# EAGLE design switch_v4 (EAGLE 9.3.1)
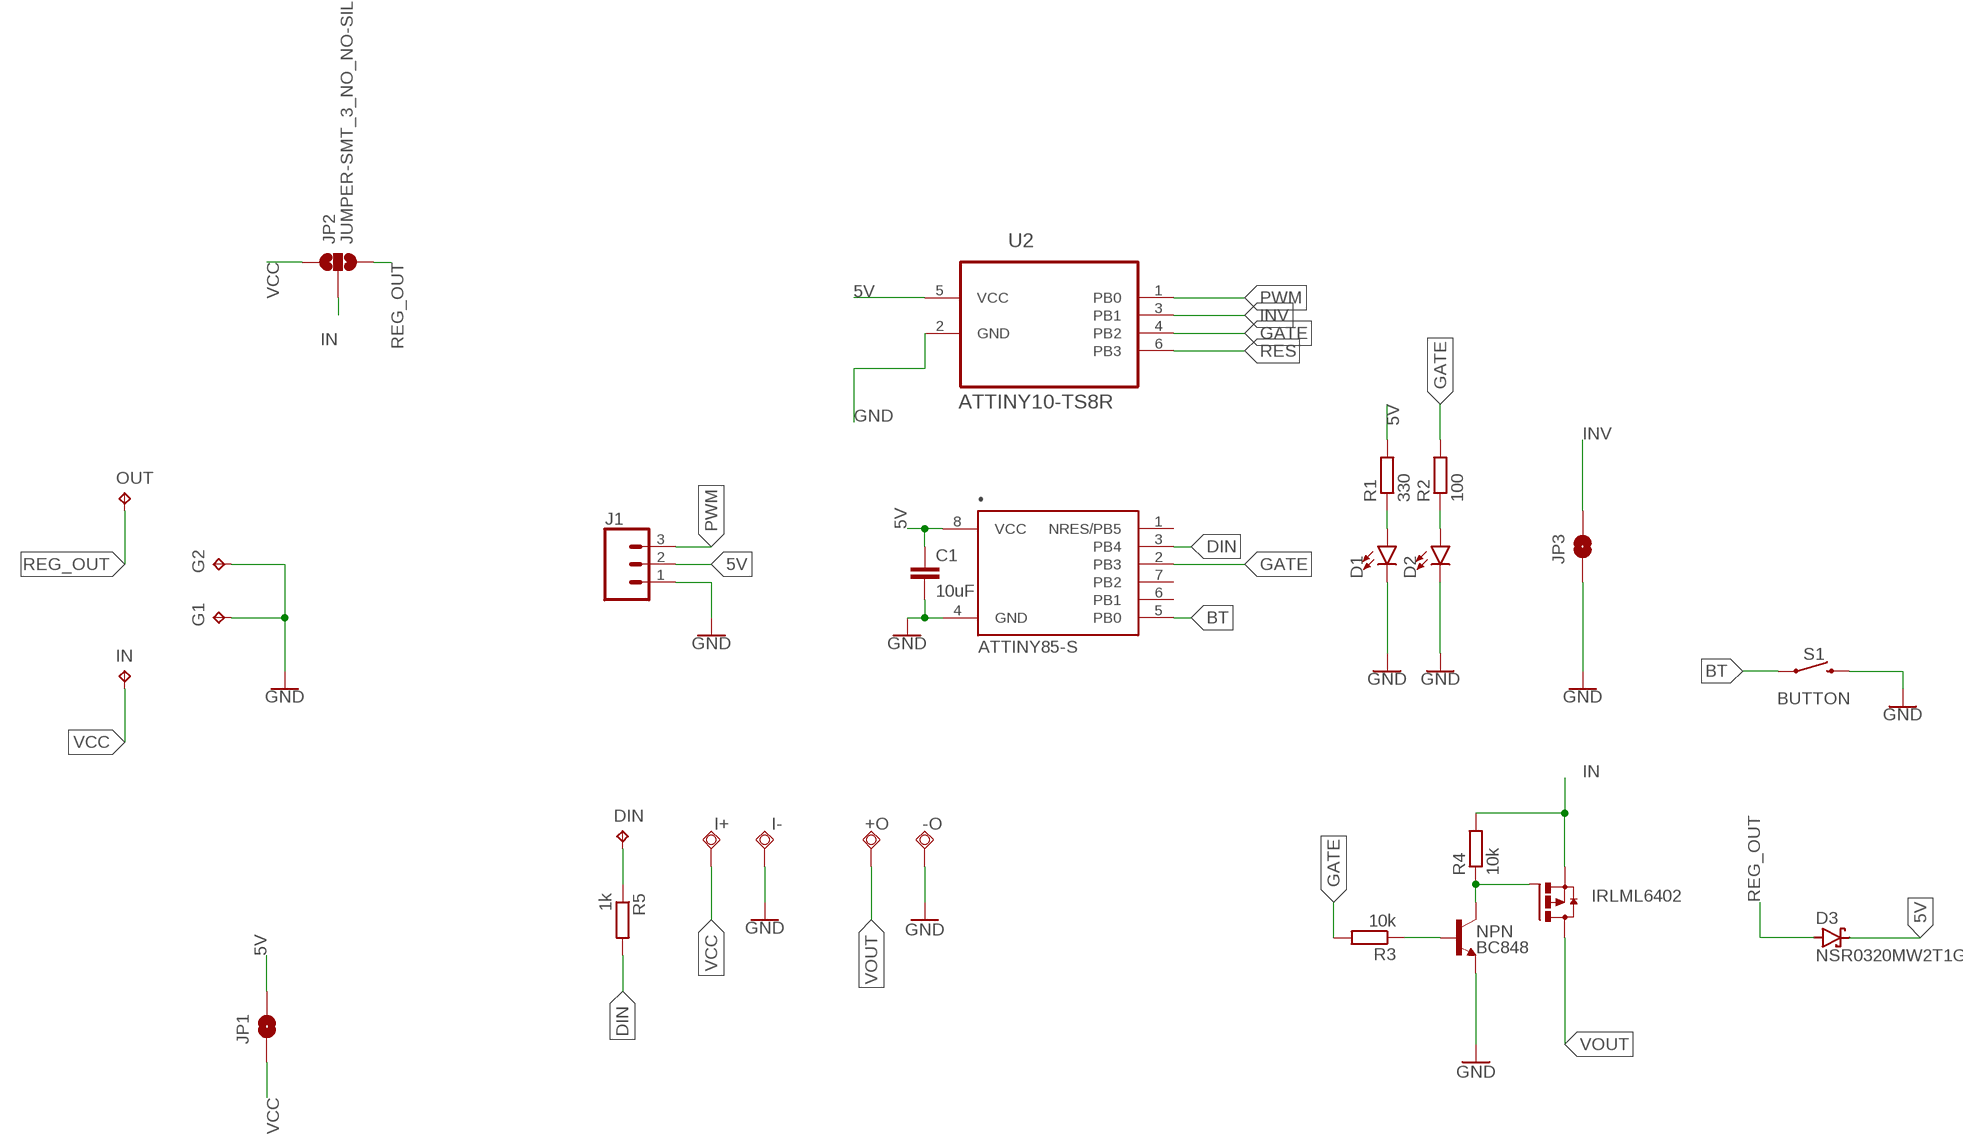
[diagram p0: schematic, sheet 1]

## Parts
+O  TPSQTP20SQ  [TP20SQ]
-O  TPSQTP20SQ  [TP20SQ]
C1  10uF  C-EUC0603K  [C0603K]
D1  LED0603  [LED-0603]
D2  LED0603  [LED-0603]
D3  NSR0320MW2T1G  BAT60J  [SOD323_ST]
DIN  TPTP15R  [TP15R]
G1  TPTP15R  [TP15R]
G2  TPTP15R  [TP15R]
I+  TPSQTP20SQ  [TP20SQ]
I-  TPSQTP20SQ  [TP20SQ]
IN  TPTP15R  [TP15R]
IRLML6402  FDN360P  [SUPER-SOT3]
J1  CONN_03  [1X03]
JP1  JUMPER-SMT_2_NO_NO-SILK  [SMT-JUMPER_2_NO_NO-SILK]
JP2  JUMPER-SMT_3_NO_NO-SILK  [SMT-JUMPER_3_NO_NO-SILK]
JP3  JUMPER-SMT_2_NO_NO-SILK  [SMT-JUMPER_2_NO_NO-SILK]
NPN  BC848  TRANS_NPN-MMBT2222AL  [SOT23-3]
OUT  TPTP15R  [TP15R]
R1  330  R-EU_R0603  [R0603]
R2  100  R-EU_R0603  [R0603]
R3  10k  R-EU_R0603  [R0603]
R4  10k  R-EU_R0603  [R0603]
R5  1k  R-EU_R0603  [R0603]
S1  BUTTON  MOMENTARY-SWITCH-SPST-SMD-4.6X2.8MM  [TACTILE_SWITCH_SMD_4.6X2.8MM]
U2  ATTINY10-TS8R  [SOT95P280X145-6N]
•  ATTINY85-S  [SOIC8_EIAJ_208MIL]

## Nets
5V: C1.1 D3.C J1.2 JP1.2 R1.2 U2.5(VCC) •.8(VCC)
BT: S1.1 S1.2 •.5(PB0)
DIN: R5.2 •.3(PB4)
GATE: R2.2 R3.2 U2.4(PB2) •.2(PB3)
GND: -O.TP C1.2 D1.C D2.C G1.TP G2.TP I-.TP J1.1 JP3.1 NPN.2(E) S1.3 S1.4 U2.2(GND) •.4(GND)
IN [vcc]: IRLML6402.2(S) JP2.2 R4.2
INV: JP3.2 U2.3(PB1)
N$1: NPN.1(B) R3.1
N$2: DIN.TP R5.1
N$3: D1.A R1.1
N$4: D2.A R2.1
NN: IRLML6402.1(G) NPN.3(C) R4.1
PWM: J1.3 U2.1(PB0)
REG_OUT: D3.A JP2.3 OUT.TP
RES: U2.6(PB3)
VCC [vcc]: I+.TP IN.TP JP1.1 JP2.1
VOUT [vcc]: +O.TP IRLML6402.3(D)
Unconnected: •.1(NRES/PB5) •.6(PB1) •.7(PB2)

## Library data of the parts
+O -O I+ I- = testpad:TPSQ: Test pad
C1 = rcl:C-EU: CAPACITOR, European symbol; SPICEPREFIX: C
D1 D2 = SparkFun-LED:LED: LED (Generic) Standard schematic elements and footprints for 5mm, 3mm, 1206, and 0603 sized LEDs. Generic LEDs with no color specified.
D3 = diode:BAT60J: Schottky barrier diode Source: www.st.com, BAT60J.pdf
DIN G1 G2 IN OUT = testpad:TP: Test pad
IRLML6402 = transistor-power:FDN360P: Single P-Channel, PowerTrench (R) MOSFET Source: http://www.fairchildsemi.com/ds/FD/FDN360P.pdf
J1 = SparkFun-Connectors:CONN_03: Multi connection point. Often used as Generic Header-pin footprint for 0.1 inch spaced/style header connections On any of the 0.1 inch spaced packages, you can populate with these: Break Away Headers - Straight <https://www.sparkfun.com/products/116> (PRT-00116) Break Away Male Headers - Right Angle <https://www.sparkfun.com/products/553> (PRT-00553) Female Headers <https://www.sparkfun.com/products/115> (PRT-00115) Break Away Headers - Machine Pin <https://www.sparkfun.com/products/117> (PRT-00117) Break Away Female Headers - Swiss Machine Pin <https://www.sparkfun.com/products/743> (PRT-00743) Stackable Header - 3 Pin (Female, 0.1") <https://www.sparkfun.com/products/13875> (PRT-13875) For SCREWTERMINALS and SPRING TERMINALS visit here: Screw Terimnals on SparkFun.com <https://www.sparkfun.com/search/results?term=Screw+Terminals> (5mm/3.5mm/2.54mm spacing) This device is also useful as a general connection point to wire up your design to another part of your project. Our various solder wires solder well into these plated through hole pads. Hook-Up Wire - Assortment (Stranded, 22 AWG) <https://www.sparkfun.com/products/11375> (PRT-11375) Hook-Up Wire - Assortment (Solid Core, 22 AWG) <https://www.sparkfun.com/products/11367> (PRT-11367) View the entire wire category on our website here <https://www.sparkfun.com/categories/141> Special notes: Molex polarized connector foot print use with SKU : PRT-08232 with associated crimp pins and housings.
JP1 JP3 = SparkFun-Jumpers:JUMPER-SMT_2_NO: Normally open jumper This jumper has two pads in close proximity to each other. Apply solder to close the connection. Round pads are easier to solder for beginners, but are a lot larger. SparkFun Product that uses the round pads: SparkFun EL Sequencer <https://www.sparkfun.com/products/12781>
JP2 = SparkFun-Jumpers:JUMPER-SMT_3_NO: Normally open jumper This jumper has three pads in close proximity to each other. Apply solder to close the connection(s).
NPN = SparkFun-DiscreteSemi:TRANS_NPN: NPN transistor Current controlled devices typically used to amplify current or used as a switch. BC547 - COM-08928 <http://www.sparkfun.com/products/8928> (TO-92 45V 100mA) (1.Collector 2.Base 3.Emitter) 2N3904 - COM-00521 <http://www.sparkfun.com/products/521> (TO-92 40V 200mA) (1.Emitter 2.Base 3.Collector) P2N2222A - COM-12852 <http://www.sparkfun.com/products/12852> (TO-92 40V 600mA) (1.Collector 2.Base 3.Emitter); PROD_ID: TRANS-08049; VALUE: 600mA/40V
R1-R5 = rcl:R-EU_: RESISTOR, European symbol; SPICEPREFIX: R
S1 = SparkFun-Switches:MOMENTARY-SWITCH-SPST: Momentary Switch (Pushbutton) - SPST Normally-open (NO) SPST momentary switches (buttons, pushbuttons). Variants PTH-12MM - 12mm square, through-hole Momentary Pushbutton Switch - 12mm Square <https://www.sparkfun.com/products/9190> (COM-09190) PTH-6.0MM, PTH-6.0MM-KIT - 6.0mm square, through-hole Mini Pushbutton Switch <https://www.sparkfun.com/products/97> (COM-00097) KIT package intended for soldering kit's - only one side of pads' copper is exposed. PTH-RIGHT-ANGLE-KIT - Right-angle, through-hole Right Angle Tactile Button <https://www.sparkfun.com/products/10791> - Used on SparkFun BigTime Watch Kit <https://www.sparkfun.com/products/11734> SMD-12MM - 12mm square, surface-mount Tactile Button - SMD (12mm) <https://www.sparkfun.com/products/12993> (COM-12993) Used on SparkFun PicoBoard <https://www.sparkfun.com/products/11888> SMD-4.5MM - 4.5mm Square Trackball Switch Used on SparkFun Blackberry Trackballer Breakout <https://www.sparkfun.com/products/13169> SMD-4.6MMX2.8MM - 4.60mm x 2.80mm, surface mount Used on SparkFun SAMD21 Mini Breakout <https://www.sparkfun.com/products/13664> SMD-5.2MM, SMD-5.2-REDUNDANT - 5.2mm square, surface-mount Mini Pushbutton Switch - SMD <https://www.sparkfun.com/products/8720> (COM-08720) Used on Arduino Pro Mini <https://www.sparkfun.com/products/11114> REDUNDANT package connects both switch circuits together SMD-6.0X3.5MM - 6.0 x 3.5mm, surface mount Momentary Reset Switch SMD <https://www.sparkfun.com/products/8229> (COM-08229) SMD-6.2MM-TALL - 6.2mm square, surface mount Tactile Button - SMD (6mm) <https://www.sparkfun.com/products/12992> Used on SparkFun Digital Sandbox <https://www.sparkfun.com/products/12651> SMD-RIGHT-ANGLE - Right-angle, surface mount Used on SparkFun Block for Intel® Edison - Arduino <https://www.sparkfun.com/products/13036>; PROD_ID: SWCH-13065
U2 = ATTINY10-TS8R:ATTINY10-TS8R: 8-bit Microcontroller with In-System Programmable Flash; AVAILABILITY: Unavailable; DESCRIPTION: Embedded microcontroller ATTINY10-TS8R SOT 23 Microchip Technology 8-Bit 10 MHz I/O number 4; MF: Microchip; MP: ATTINY10-TS8R; PACKAGE: SOT-23-6 Microchip; PRICE: None
• = _hhn_attiny25_45_85:ATTINY85*: ATMEL ATtiny 85 Packages: P = PDIP 08 30mil S = SOIC 08 EIAJ 208mil Technologies Note: for complete ordering code (temp. range, finish, tape&reel etc.) see www.atmel.com • Supply Voltage: V = (1.8…5.5)V | [blank] = (2.7…5.5)V • Speed: 10 = 10 MHz | 20 = 20 MHz Author: Dipl.-Ing. FH Rainer Bayer HHN Hochschule Heilbronn (Heilbronn University), rainer.bayer@hs-heilbronn.de Ingenieurbüro ing-rb, mail@ing-rb.de

## Net classes
1 vcc: width 0.5 mm, clearance 0.381 mm

## Board
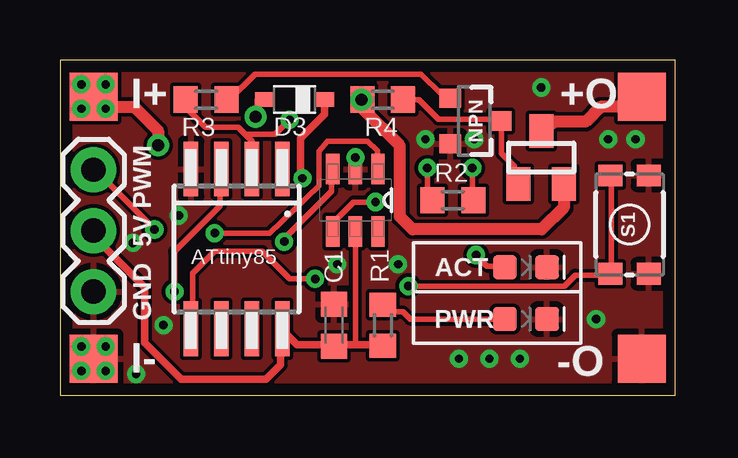
[diagram p1: board, top side]
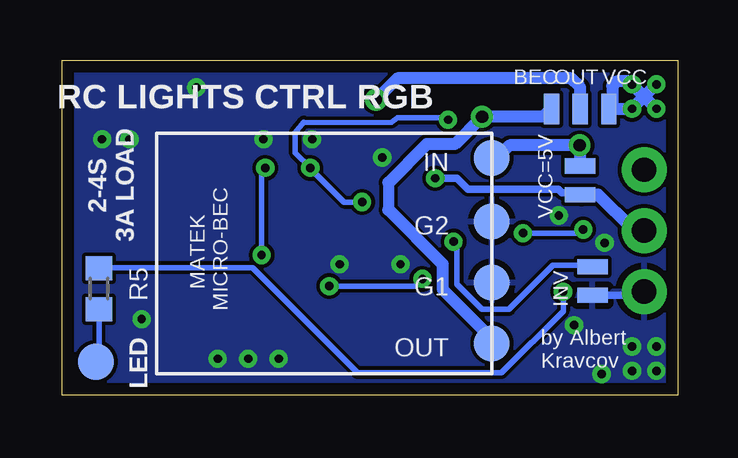
[diagram p2: board, bottom side, seen from below]

Size 25.65 x 13.97 mm. Coordinates in mm from the lower left corner, seen from the top.
Outline: 0,0 25.65,0 25.65,13.97 0,13.97 0,0
Copper layers (1*16): Top 0.035mm / dielectric 1.5mm / Bottom 0.035mm
Design rules "default *": minimum track width 6mil, minimum drill 0.35mm, track to track 6mil, track to pad 6mil, pad to pad 6mil, via to via 6mil, smd to smd 6mil, copper to edge 0.5mm, drill to drill 6mil, minimum pad ring 10mil, minimum via ring 8mil, stop-mask expansion 4mil, vias tented up to drill 2mm, thermal gap 10mil

### Footprints (pad centres in the part's own frame; a part is rotated, then mirrored left to right if it is on the bottom)
TP20SQ = smd 2 x 2: TP 0,0
C0603K = smd 1.05 x 1.08: 1 -0.875,0; 2 0.875,0
LED-0603 = smd 1 x 1: A -0.877,0; C 0.877,0
SOD323_ST = smd 0.8 x 0.6: A 1.25,0; C -1.25,0
TP15R = smd 1.5 x 1.5: TP 0,0
SUPER-SOT3 = smd 1 x 1.4: 1 -0.95,-1.1; 2 0.95,-1.1; 3 0,1.1
1X03 = drill 1.016 pad 1.88: 1 0,0; 2 2.54,0; 3 5.08,0
SMT-JUMPER_2_NO_NO-SILK = smd 0.635 x 1.27: 1 -0.66,0; 2 0.533,0
SMT-JUMPER_3_NO_NO-SILK = smd 0.635 x 1.27: 1 -1.194,0; 2 0,0; 3 1.194,0
SOT23-3 = smd 0.8 x 0.9: 1 -0.95,-1; 2 0.95,-1; 3 0,1.1
R0603 = smd 1 x 1.1: 1 -0.85,0; 2 0.85,0
TACTILE_SWITCH_SMD_4.6X2.8MM = smd 0.9 x 1: 1 -2.05,-0.8; 2 2.05,-0.8; 3 2.05,0.8; 4 -2.05,0.8
SOT95P280X145-6N = smd 1.27 x 0.559: 1 -1.295,0.94; 2 -1.295,0; 3 -1.295,-0.94; 4 1.295,-0.94; 5 1.295,0; 6 1.295,0.94
SOIC8_EIAJ_208MIL = smd 0.6 x 2.286: 1 -1.905,-3.33; 2 -0.635,-3.33; 3 0.635,-3.33; 4 1.905,-3.33; 5 1.905,3.33; 6 0.635,3.33; 7 -0.635,3.33; 8 -1.905,3.33

### Placement (x,y rotation side)
+O  24.26,12.45 0 top
-O  24.26,1.52 0 top
C1  11.43,2.92 90 top
D1  19.43,3.17 0 top
D2  19.43,5.33 0 top
D3  9.78,12.32 180 top
DIN  24.26,1.4 0 bottom
G1  7.75,4.7 0 bottom
G2  7.75,7.24 0 bottom
I+  1.4,12.45 0 top
I-  1.4,1.52 0 top
IN  7.75,9.88 0 bottom
IRLML6402  20.07,9.91 0 top
J1  1.4,4.32 90 top
JP1  4.06,8.89 270 bottom
JP2  4.06,11.94 180 bottom
JP3  3.56,4.83 90 bottom
NPN  17.27,11.43 270 top
OUT  7.75,2.16 0 bottom
R1  13.46,2.92 270 top
R2  16.38,8.13 180 top
R3  6.1,12.32 180 top
R4  13.46,12.32 180 top
R5  24.13,4.44 90 bottom
S1  23.75,7.11 270 top
U2  12.32,8.13 270 top
•  7.37,6.1 180 top

### Tracks (layer width: path | path; a pad name or v marks a point on that pad's centre or on a via)
5V  (via drill 0.35)
  Top 0.152: 13.31,2.11 13.46,1.96 R1.2 | 11.48,2.11 C1.1 11.41,2.11 | 9.27,2.72 •.8 9.5,2.41 9.2,2.11 | 10.03,9.04 10.07,9 v10.11,9.04 | D3.C | 1.42,6.83 J1.2
  Top 0.229: 12.32,2.11 U2.5
  Top 0.305: 13.31,2.11 12.32,2.11 11.48,2.11 | 11.41,2.11 9.88,2.11 9.27,2.72 | D3.C 11.02,11.71 10.03,10.72 10.03,9.04 | 9.2,2.11 9.2,1.27 8.59,0.66 5.05,0.66 3.53,2.18 3.53,4.5 1.42,6.6 1.42,6.83
  Bottom 0.152: 4.01,8.43 4.01,8.28 4.12,8.28 4.27,8.43 | 1.42,6.91 J1.2
  Bottom 0.305: v10.11,9.04 9.2,9.04 8.74,8.58 4.98,8.58 4.83,8.43 4.27,8.43
  Bottom 0.5: 3.33,8.36 JP1.2 4.06,8.33 4.01,8.28
  Bottom 0.508: 3.33,8.36 1.88,6.91 1.42,6.91
BT  (via drill 0.35)
  Top 0.152: 5.54,2.87 5.46,2.79 •.5 | 22.99,5.08 S1.2 22.91,5 | 22.99,9.12 S1.1
  Top 0.229: 5.54,2.87 5.54,5.08 6.45,5.99 8.43,5.99 9.58,4.85 v10.64,4.85 | 22.99,9.12 22.99,5.08 | 22.91,5 21.49,5 21.03,4.55 v14.53,4.55
  Bottom 0.229: v14.53,4.55 10.95,4.55 v10.64,4.85
DIN  (via drill 0.35)
  Top 0.152: 6.68,9.42 •.3
  Top 0.229: v4.77,4.32 4.77,5.99 6.68,7.9 6.68,9.42
  Bottom 0.152: R5.2
  Bottom 0.229: R5.2 17.73,5.31 13.36,0.94 7.34,0.94 4.77,3.5 v4.77,4.32
GATE  (via drill 0.35)
  Top 0.152: 5.31,11.94 5.31,12.32 R3.2 | 15.32,8.53 R2.2 | 11.41,7.21 11.41,6.83 U2.4
  Top 0.229: 5.31,11.94 6.07,11.18 7.42,11.18 7.72,10.87 | v15.32,9.47 15.32,8.53 | v9.58,11.48 8.97,10.87 7.72,10.87 | 11.41,7.21 12.24,8.05 v13.16,8.05 | •.2 8,10.59 7.72,10.87
  Bottom 0.203: 15.6,11.38 11.94,11.38
  Bottom 0.229: 15.6,11.38 15.95,10.95 15.95,10.11 v15.32,9.47 15.32,9.45 13.92,8.05 v13.16,8.05 | 11.94,11.38 11.68,11.56 9.65,11.56 v9.58,11.48
GND  (via drill 0.35)
  Bottom 0.152: J1.1 1.55,4.17
  Bottom 0.305: 1.55,4.17 JP3.1
  other vias: 0.89,2.03 0.89,1.02 1.91,1.02 1.91,2.03 4.95,7.49 12.32,9.91 11.56,5.46 14.1,5.46 22.86,10.67 22.35,3.17 17.27,10.67 24,10.67 20.07,12.83 15.24,10.67 16.64,1.52 17.91,1.52 19.18,1.52 3.05,6.35 3.17,0.89 4.32,2.92
  pour Top: -1.14,15.75 28.07,15.75 28.07,-2.03 -1.14,-2.03
  pour Bottom: -1.14,14.48 28.07,14.48 28.07,-2.03 -1.14,-2.03
IN  (via drill 0.51)
  Top 0.5: IRLML6402.2 21.01,8.74 21.01,7.82 20.09,6.91 14.71,6.91 14.17,7.44 14.17,10.39 12.62,11.94 R4.2 v12.57,12.32
  Bottom 0.5: v12.57,12.32 11.68,13.21 4.44,13.21 4.06,12.83 JP2.2
INV  (via drill 0.35)
  Top 0.152: 11.33,9.42 U2.3
  Top 0.229: v9.35,6.4 9.35,6.53 11.33,8.51 11.33,9.42
  Bottom 0.152: JP3.2 3.67,5.25
  Bottom 0.229: 3.67,5.25 3.83,5.41 5.21,5.41 7.04,3.58 8.15,3.58 9.2,4.62 9.2,6.25 v9.35,6.4
N$1
  Top 0.152: R3.1 7.06,12.32 | 16,12.55 NPN.1
  Top 0.229: 16,12.55 15.9,12.55 15.06,13.39 8.13,13.39 7.06,12.32
N$2
  Bottom 0.152: 24.13,1.5 24.21,1.42 DIN.TP
  Bottom 0.229: 24.13,1.5 R5.1
N$3
  Top 0.152: 13.61,3.48 13.46,3.63 R1.1
  Top 0.229: D1.A 14.61,3.17 14.3,3.48 13.61,3.48
N$4  (via drill 0.35)
  Top 0.152: 18.49,5.39 D2.A | 17.2,8.15 R2.1
  Top 0.229: 18.49,5.39 17.8,5.39 v17.35,5.84 | 17.2,8.15 v17.2,9.47
  Bottom 0.152: v17.2,9.47 17.35,9.32
  Bottom 0.229: 17.35,9.32 v17.35,5.84
NN
  Top 0.152: 18.95,8.97 19.1,8.81 IRLML6402.1 | 18.41,11.43 NPN.3 18.37,11.51
  Top 0.229: 18.41,11.43 18.41,10.08 18.95,9.55 18.95,8.97 | R4.1 14.96,12.32 15.77,11.51 18.37,11.51
PWM  (via drill 0.35)
  Top 0.152: 13.23,9.42 U2.1
  Top 0.229: v3.94,6.91 3.94,6.93 1.47,9.4 J1.3 | 13.23,9.42 13.23,10.19 12.83,10.59 11.15,10.59 10.79,10.16 10.79,8.74 8.74,6.76 v6.45,6.76
  Bottom 0.229: v6.45,6.76 4.09,6.76 v3.94,6.91
REG_OUT  (via drill 0.51)
  Top 0.152: 8.26,12.32 D3.A
  Top 0.305: 8.26,12.32 8.26,11.61 v8.15,11.61
  Bottom 0.152: 7.75,2.36 OUT.TP
  Bottom 0.457: 12.07,8.86 12.07,7.72
  Bottom 0.5: JP2.3 5.28,11.94
  Bottom 0.508: 5.28,11.94 5.61,11.61 v8.15,11.61 9.3,10.47 10.46,10.47 12.07,8.86 | 7.75,2.36 9.8,4.42 9.8,5.46 12.07,7.72
VCC  (via drill 0.35, 0.51)
  Top 0.5: v4.09,10.41 4.09,11.02 3.1,12.01 1.8,12.01 1.4,12.42 I+.TP | I+.TP v1.91,11.94 | I+.TP v0.89,11.94
  Bottom 0.5: IN.TP 7.62,9.8 7.01,10.41 v4.09,10.41 4.06,10.39 JP1.1 | v0.89,11.94 v1.91,12.95 2.03,13.08 2.54,13.08 2.73,12.89 2.73,11.94 | v0.89,12.95 v1.91,11.94 2.73,11.94 | JP2.1 2.73,11.94
VOUT
  Top 0.5: +O.TP 23.82,12.01 22.53,12.01 21.92,11.41 20.64,11.41 IRLML6402.3

### Text on the board
tNames: PWM | 5V | ATtiny85 | ACT | GND | PWR
bNames: VCC | OUT | BEC | RC LIGHTS CTRL RGB | 2-4S / 3A LOAD | VCC=5V | MATEK / MICRO-BEC | INV | LED | by Albert / Kravcov
_tNames: D3 | I+ | R5 | R4 | NPN | +O | R2 | • | S1 | C1 | R1 | I- | -O
_bNames: OUT | G2 | INV | G1 | IN